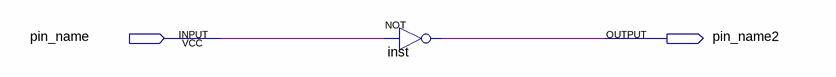
[diagram p0: schematic sheet]
// Quartus schematic button.bdf as structural Verilog: 1 symbols, 2 pins
module button (
  input  pin_name,
  output pin_name2
);

  not inst (pin_name2, pin_name);
endmodule
